# Altium schematic sheet TW3-16上盖控制板V0.2.SchDoc
size A3
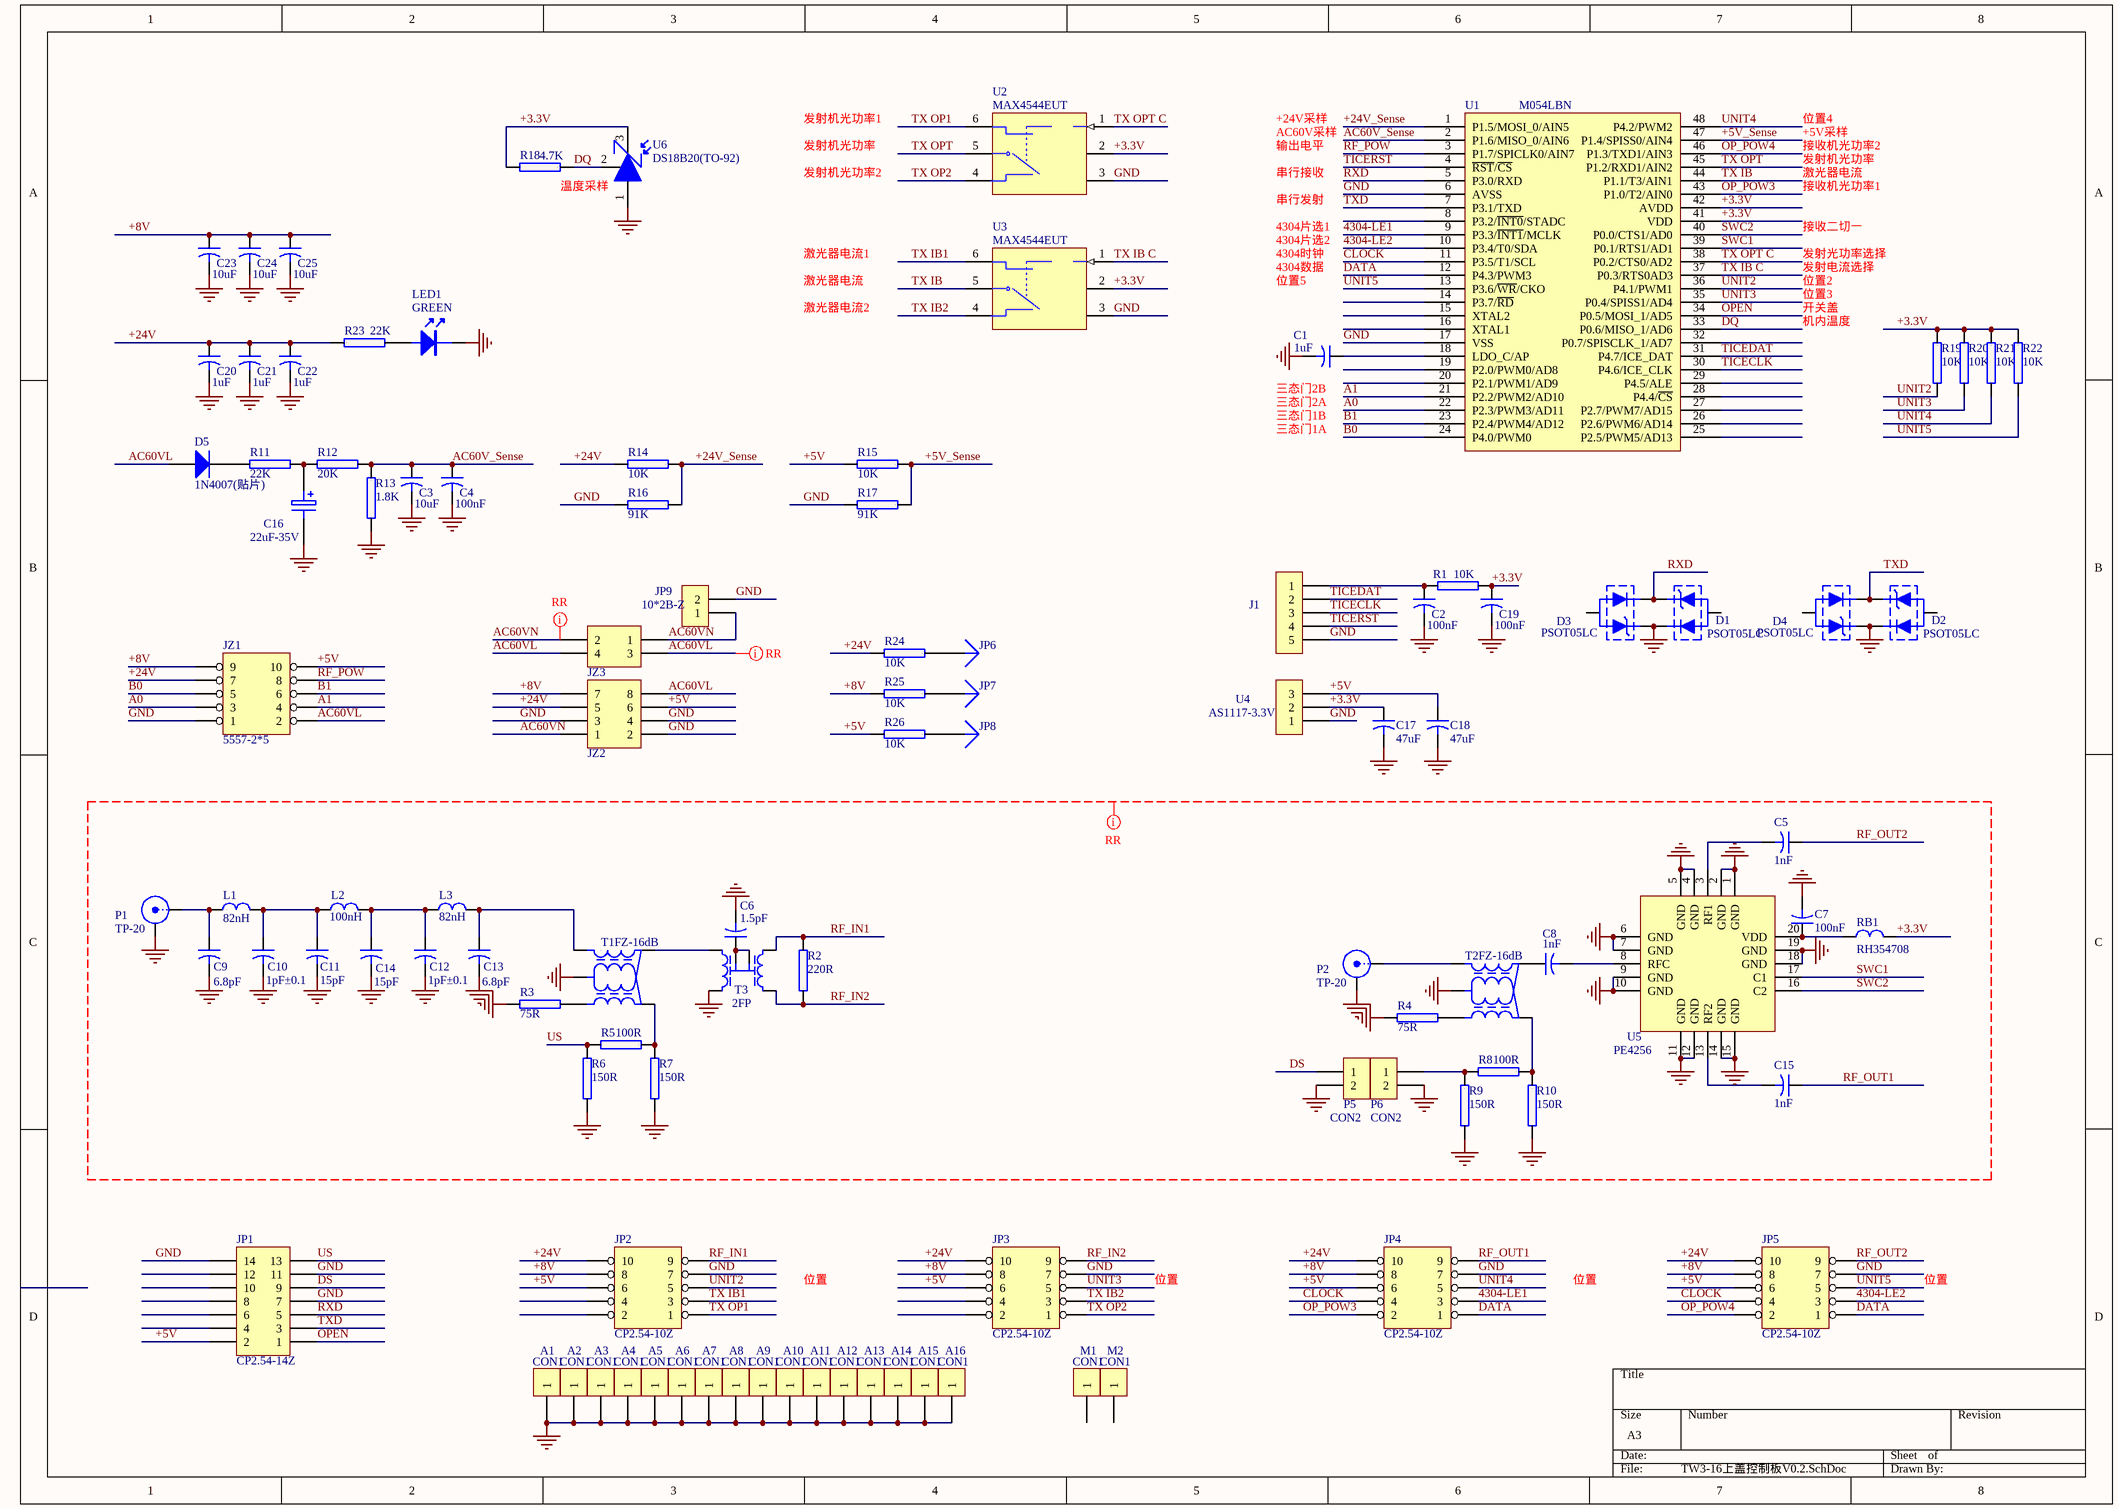
[diagram p0: TW3-16上盖控制板V0.2.SchDoc]

## Parts
A1  CON1  [PAD-6mm]
A2  CON1  [PAD-6mm]
A3  CON1  [PAD-6mm]
A4  CON1  [PAD-6mm]
A5  CON1  [PAD-6mm]
A6  CON1  [PAD-6mm]
A7  CON1  [PAD-6mm]
A8  CON1  [PAD-6mm]
A9  CON1  [PAD-6mm]
A10  CON1  [PAD-6mm]
A11  CON1  [PAD-6mm]
A12  CON1  [PAD-6mm]
A13  CON1  [PAD-6mm]
A14  CON1  [PAD-6mm]
A15  CON1  [PAD-6mm]
A16  CON1  [PAD-6mm]
C1  value 1uF  [0603]  (hidden comment: CT41-0603-B1uF-25V-K)
C2  value 100nF  [0603]  (hidden comment: CT41-0603-B100nF-50V-K)
C3  value 10uF  [1206]  (hidden comment: 16V-10uF±10%-X7R-1206)
C4  value 100nF  [0603]  (hidden comment: CT41-0603-B100nF-50V-K)
C5  value 1nF  [0603]  (hidden comment: CT41-0603-B1nF-50V-J)
C6  value 1.5pF  [0603]  (hidden comment: CC41-0603-CG1.5pF-50V-C)
C7  value 100nF  [0603]  (hidden comment: CT41-0603-B100nF-50V-K)
C8  value 1nF  [0603]  (hidden comment: CT41-0603-B1nF-50V-J)
C9  value 6.8pF  [0603]  (hidden comment: CC41-0603-CG6.8pF-50V-C)
C10  value 1pF±0.1  [0603]  (hidden comment: CC41-0603-CG1pF-50V-B)
C11  value 15pF  [0603]  (hidden comment: CC41-0603-CG15pF-50V-J)
C12  value 1pF±0.1  [0603]  (hidden comment: CC41-0603-CG1pF-50V-B)
C13  value 6.8pF  [0603]  (hidden comment: CC41-0603-CG6.8pF-50V-C)
C14  value 15pF  [0603]  (hidden comment: CC41-0603-CG15pF-50V-J)
C15  value 1nF  [0603]  (hidden comment: CT41-0603-B1nF-50V-J)
C16  value 22uF-35V  [RB-SMT-6.3X5.4]  (hidden comment: SCD11-6.3*5.4-22uF-35V-K)
C17  value 47uF  [1206]  (hidden comment: CT41-1206-F476-10V-M)
C18  value 47uF  [1206]  (hidden comment: CT41-1206-F476-10V-M)
C19  value 100nF  [0603]  (hidden comment: CT41-0603-B100nF-50V-K)
C20  value 1uF  [1206]  (hidden comment: CT41-1206-B1uF-50V-K)
C21  value 1uF  [1206]  (hidden comment: CT41-1206-B1uF-50V-K)
C22  value 1uF  [1206]  (hidden comment: CT41-1206-B1uF-50V-K)
C23  value 10uF  [1206]  (hidden comment: 16V-10uF±10%-X7R-1206)
C24  value 10uF  [1206]  (hidden comment: 16V-10uF±10%-X7R-1206)
C25  value 10uF  [1206]  (hidden comment: 16V-10uF±10%-X7R-1206)
D1  value PSOT05LC  [SOT-23]  (hidden comment: 集成块)
D2  value PSOT05LC  [SOT-23]  (hidden comment: 集成块)
D3  value PSOT05LC  [SOT-23]  (hidden comment: 集成块)
D4  value PSOT05LC  [SOT-23]  (hidden comment: 集成块)
D5  1N4007(贴片)  [DO-SMA]
J1  IDC单排插针  [SIP5]  (value not drawn)
JP1  Vallue: CP2.54-14Z  [IDC-14Z]  (hidden comment: CP2.54-14Z-S-K(排母))
JP2  value CP2.54-10Z  [IDC-10Z]  (hidden comment: CP2.54-10Z-S-K(排母))
JP3  value CP2.54-10Z  [IDC-10Z]  (hidden comment: CP2.54-10Z-S-K(排母))
JP4  value CP2.54-10Z  [IDC-10Z]  (hidden comment: CP2.54-10Z-S-K(排母))
JP5  value CP2.54-10Z  [IDC-10Z]  (hidden comment: CP2.54-10Z-S-K(排母))
JP6  CK-1A  [TEST1]  (value not drawn)
JP7  CK-1A  [TEST1]  (value not drawn)
JP8  CK-1A  [TEST1]  (value not drawn)
JP9  10*2B-Z  [AC-10mm]
JZ1  5557-2*5  [5557-2*5]
JZ2  5557-8A  [5557-2X4]  (value not drawn)
JZ3  5557-2*2座  [5557-2X2]  (value not drawn)
L1  value 82nH  [0805]  (hidden comment: HDW0805UC082JGT)
L2  value 100nH  [0805]  (hidden comment: HDW0805UCR10JGT)
L3  value 82nH  [0805]  (hidden comment: HDW1008UC082JGT)
LED1  value GREEN  [1206-D]  (hidden comment: LED-1206-G(SMD))
M1  CON1  [MArK-1]
M2  CON1  [MArK-1]
P1  value TP-20  [PAD-DLJT2]  (hidden comment: 02TV阳座)
P2  value TP-20  [PAD-DLJT2]  (hidden comment: 02TV阳座)
P5  CON2  [PAD-DLJT2]
P6  CON2  [PAD-DLJT2]
R1  value 10K  [0603]  (hidden comment: SRI11-0603-10KΩ-J)
R2  value 220R  [0603]  (hidden comment: SRI11-0603-220Ω-J)
R3  value 75R  [0603]  (hidden comment: SRI11-0603-75Ω-J)
R4  value 75R  [0603]  (hidden comment: SRI11-0603-75Ω-J)
R5  value 100R  [0603]  (hidden comment: SRI11-0603-100Ω-J)
R6  value 150R  [0603]  (hidden comment: SRI11-0603-150Ω-J)
R7  value 150R  [0603]  (hidden comment: SRI11-0603-150Ω-J)
R8  value 100R  [0603]  (hidden comment: SRI11-0603-100Ω-J)
R9  value 150R  [0603]  (hidden comment: SRI11-0603-150Ω-J)
R10  value 150R  [0603]  (hidden comment: SRI11-0603-150Ω-J)
R11  value 22K  [0805]  (hidden comment: SRI11-0805-22KΩ-J)
R12  value 20K  [0805]  (hidden comment: SRI11-0805-20KΩ-J)
R13  value 1.8K  [0805]  (hidden comment: SRI11-0805-1.8KΩ-J)
R14  value 10K  [0603]  (hidden comment: SRI11-0603-10KΩ-J)
R15  value 10K  [0603]  (hidden comment: SRI11-0603-10KΩ-J)
R16  value 91K  [0603]  (hidden comment: SRI11-0603-91KΩ-J)
R17  value 91K  [0603]  (hidden comment: SRI11-0603-91KΩ-J)
R18  value 4.7K  [0603]  (hidden comment: SRI11-0603-4.7KΩ-J)
R19  value 10K  [0603]  (hidden comment: SRI11-0603-10KΩ-J)
R20  value 10K  [0603]  (hidden comment: SRI11-0603-10KΩ-J)
R21  value 10K  [0603]  (hidden comment: SRI11-0603-10KΩ-J)
R22  value 10K  [0603]  (hidden comment: SRI11-0603-10KΩ-J)
R23  value 22K  [0603]  (hidden comment: SRI11-0603-22KΩ-J)
R24  value 10K  [0603]  (hidden comment: SRI11-0603-10KΩ-J)
R25  value 10K  [0603]  (hidden comment: SRI11-0603-10KΩ-J)
R26  value 10K  [0603]  (hidden comment: SRI11-0603-10KΩ-J)
RB1  RH354708  [L12MM]
T1  value FZ-16dB  [T-SM16]  (hidden comment: F06401C)
T2  value FZ-16dB  [T-SM16]  (hidden comment: F06401C)
T3  value 2FP  [STB-RG33]  (hidden comment: F06502S)
U1  M054LBN  [LQFP-48]
U2  value MAX4544EUT  [SOT23-6]  (hidden comment: 集成块)
U3  value MAX4544EUT  [SOT23-6]  (hidden comment: 集成块)
U4  AS1117-3.3V  [SOT-223-3L]
U5  value PE4256  [QFN-20]  (hidden comment: PE4256DS)
U6  DS18B20(TO-92)  [TO-92-78L]

## Nets
GND: A1.1 A2.1 A3.1 A4.1 A5.1 A6.1 A7.1 A8.1 A9.1 A10.1 A11.1 A12.1 A13.1 A14.1 A15.1 A16.1 C1.2 C2.2 C3.2 C4.2 C6.2 C7.2 C9.2 C10.2 C11.2 C12.2 C13.2 C14.2 C16.2 C17.2 C18.2 C19.2 C20.2 C21.2 C22.2 C23.2 C24.2 C25.2 D1.2 D2.2 D3.1 D4.1 J1.5 JP1.7 JP1.11 JP1.14 JP2.7 JP3.7 JP4.7 JP5.7 JP9.2 JZ1.1 JZ2.2 JZ2.3 JZ2.4 LED1.2(C) P1.2(Y) P2.2(Y) P5.2 P6.2 R3.2 R4.2 R6.2 R7.2 R9.2 R10.2 R13.2 R16.2 R17.2 T1.5 T2.5 T3.2 U1.6(AVSS) U1.17(VSS) U2.3(GND) U3.3(GND) U4.1 U5.1(GND) U5.2(GND) U5.4(GND) U5.5(GND) U5.6(GND) U5.7(GND) U5.9(GND) U5.10(GND) U5.11(GND) U5.12(GND) U5.14(GND) U5.15(GND) U5.18(GND) U5.19(GND) U6.1(GND)
4304-LE1: JP4.3 U1.9(P3.3/~{INT1}/MCLK)
4304-LE2: JP5.3 U1.10(P3.4/T0/SDA)
+3.3V: C17.1 C19.1 R1.2 R18.2 R19.1 R20.1 R21.1 R22.1 RB1.2 U1.41(VDD) U1.42(AVDD) U2.2(V+) U3.2(V+) U4.2 U6.3(Vdd)
+5V: C18.1 JP1.2 JP2.6 JP3.6 JP4.6 JP5.6 JZ1.10 JZ2.6 R15.2 R26.2 U4.3
+5V_Sense: R15.1 R17.1 U1.47(P1.4/SPISS0/AIN4)
+8V: C23.1 C24.1 C25.1 JP2.8 JP3.8 JP4.8 JP5.8 JZ1.9 JZ2.7 R25.2
+24V: C20.1 C21.1 C22.1 JP2.10 JP3.10 JP4.10 JP5.10 JZ1.7 JZ2.5 R14.2 R23.1 R24.2
+24V_Sense: R14.1 R16.1 U1.1(P1.5/MOSI_0/AIN5)
A0: JZ1.3 U1.22(P2.3/PWM3/AD11)
A1: JZ1.4 U1.21(P2.2/PWM2/AD10)
AC60V_Sense: C3.1 C4.1 R12.2 R13.1 U1.2(P1.6/MISO_0/AIN6)
AC60VL: D5.1(A) JZ1.2 JZ2.8 JZ3.3 JZ3.4
AC60VN: JP9.1 JZ2.1 JZ3.1 JZ3.2
B0: JZ1.5 U1.24(P4.0/PWM0)
B1: JZ1.6 U1.23(P2.4/PWM4/AD12)
CLOCK: JP4.4 JP5.4 U1.11(P3.5/T1/SCL)
DATA: JP4.1 JP5.1 U1.12(P4.3/PWM3)
DQ: R18.1 U1.33(P0.6/MISO_1/AD6) U6.2(DQ)
DS: JP1.9 P5.1
OP_POW3: JP4.2 U1.43(P1.0/T2/AIN0)
OP_POW4: JP5.2 U1.46(P1.3/TXD1/AIN3)
OPEN: JP1.1 U1.34(P0.5/MOSI_1/AD5)
RF_IN1: JP2.9 R2.2 T3.4(OUT)
RF_IN2: JP3.9 R2.1 T3.3(OUT)
RF_OUT1: C15.1 JP4.9
RF_OUT2: C5.1 JP5.9
RF_POW: JZ1.8 U1.3(P1.7/SPICLK0/AIN7)
RXD: D1.1 D3.2 JP1.5 U1.5(P3.0/RXD)
SWC1: U1.39(P0.1/RTS1/AD1) U5.17(C1)
SWC2: U1.40(P0.0/CTS1/AD0) U5.16(C2)
TICECLK: J1.3 U1.30(P4.6/ICE_CLK)
TICEDAT: J1.2 U1.31(P4.7/ICE_DAT)
TICERST: J1.4 U1.4(~{RST}/~{CS})
TX IB: U1.44(P1.1/T3/AIN1) U3.5(COM)
TX IB1: JP2.3 U3.6(NO)
TX IB2: JP3.3 U3.4(NC)
TX IB C: U1.37(P0.3/RTS0AD3) U3.1(IN)
TX OP1: JP2.1 U2.6(NO)
TX OP2: JP3.1 U2.4(NC)
TX OPT: U1.45(P1.2/RXD1/AIN2) U2.5(COM)
TX OPT C: U1.38(P0.2/CTS0/AD2) U2.1(IN)
TXD: D2.1 D4.2 JP1.3 U1.7(P3.1/TXD)
UNIT2: JP2.5 R19.2 U1.36(P4.1/PWM1)
UNIT3: JP3.5 R20.2 U1.35(P0.4/SPISS1/AD4)
UNIT4: JP4.5 R21.2 U1.48(P4.2/PWM2)
UNIT5: JP5.5 R22.2 U1.13(P3.6/~{WR}/CKO)
US: JP1.13 R5.2 R6.1
NetC1_1: C1.1 U1.18(LDO_C/AP)
NetC2_1: C2.1 J1.1 R1.1
NetC5_2: C5.2 U5.3(RF1)
NetC6_1: C6.1 T3.5 T3.6
NetC7_1: C7.1 RB1.1 U5.20(VDD)
NetC8_1: C8.1 T2.2
NetC8_2: C8.2 U5.8(RFC)
NetC9_1: C9.1 L1.1 P1.1(X)
NetC10_1: C10.1 C11.1 L1.2 L2.1
NetC12_1: C12.1 C14.1 L2.2 L3.1
NetC13_1: C13.1 L3.2 T1.1
NetC15_2: C15.2 U5.13(RF2)
NetC16_1: C16.1 R11.2 R12.1
NetD5_2: D5.2(K) R11.1
NetJP6_1: JP6.1 R24.1
NetJP7_1: JP7.1 R25.1
NetJP8_1: JP8.1 R26.1
NetLED1_1: LED1.1(A) R23.2
NetP2_1: P2.1(X) T2.1
NetP6_1: P6.1 R8.2 R9.1
NetR3_1: R3.1 T1.3
NetR4_1: R4.1 T2.3
NetR5_1: R5.1 R7.1 T1.4
NetR8_1: R8.1 R10.1 T2.4
NetT1_2: T1.2 T3.1(IN)

Not connected (* = marked no-connect by the designer): D1 3; D2 3; D3 3; D4 3; JP1 4 6 8 10 12; JP2 2 4; JP3 2 4; M1 1; M2 1; U1 8(P3.2/~{INT0}/STADC) 14(P3.7/~{RD}) 15(XTAL2) 16(XTAL1) 19(P2.0/PWM0/AD8) 20(P2.1/PWM1/AD9) 25(P2.5/PWM5/AD13) 26(P2.6/PWM6/AD14) 27(P2.7/PWM7/AD15) 28(P4.4/~{CS}) 29(P4.5/ALE) 32(P0.7/SPISCLK_1/AD7)

## Layout directives
net class RF: +3.3V, AC60VL, AC60VN, DS, GND, RF_IN1, RF_IN2, RF_OUT1, RF_OUT2, SWC1, SWC2, US

## Notes on the sheet
- 发射机光功率1
- 发射机光功率2
- 发射机光功率
- 输出电平
- +24V采样
- AC60V采样
- 串行接收
- 接收机光功率2
- 位置4
- +5V采样
- 激光器电流
- (near R18) 温度采样
- 4304片选1
- 4304片选2
- 串行发射
- 接收机光功率1
- 接收二切一
- 激光器电流1
- 激光器电流2
- 4304时钟
- 4304数据
- 位置5
- 位置2
- 位置3
- 开关盖
- 发射光功率选择
- 发射电流选择
- 机内温度
- 三态门1A
- 三态门1B
- (near C1) 三态门2A
- (near C1) 三态门2B
- 位置

## Library data of the parts
A1-A16 M1 M2 = CON1: Connector
C1 = Cap2: 贴片电容; Materiel Code: 30.01.00.0001500
C2 C4 C7 C19 = Cap2: 贴片电容; Materiel Code: 30.01.00.0001400
C3 C23-C25 = Cap2: 贴片电容; Materiel Code: 30.01.00.0015100
C5 C8 C15 = Cap2: 贴片电容; Materiel Code: 30.01.00.0001102
C6 = Cap2: 贴片电容; Materiel Code: 30.01.00.0002000
C9 C13 = Cap2: 贴片电容; Materiel Code: 30.01.00.0033100
C10 C12 = Cap2: 贴片电容; Materiel Code: 30.01.00.0001901
C11 C14 = Cap2: 贴片电容; Materiel Code: 30.01.00.0032200
C16 = ELECTRO1: 贴片铝电解电容; Materiel Code: 30.01.02.0000200
C17 C18 = Cap2: 贴片电容; Materiel Code: 30.01.00.0027600
C20-C22 = Cap2: 贴片电容; Materiel Code: 30.01.00.0015000
D1-D4 = PSOT05LC: Materiel Code: 30.05.00.0010800
D5 = Diode 1N4007: 贴片二极管; Materiel Code: 30.03.01.0000200; Value: 1N4007
J1 = CON5: 1×5（2.54mm）; Materiel Code: 30.08.06.0001000; Value: 1×5（2.54mm）
JP1 = Header 7X2: 双排14芯插座; Materiel Code: 30.09.04.0003700
JP2-JP5 = HEADER 5X2: 双排10芯插座; Materiel Code: 30.09.04.0003100
JP6-JP8 = Plug: 测试柱; Materiel Code: 30.09.06.0004800; Value: *
JP9 = CON2: 二芯针座; Materiel Code: 30.09.06.0000100; Value: *
JZ1 = HEADER 5X2: 十芯插座; Materiel Code: 30.08.06.0008900; Value: *
JZ2 = Header 4X2H: 八芯插座; Materiel Code: 30.09.06.0018400; Value: *
JZ3 = Header 2X2H: 4芯插座; Materiel Code: 30.09.06.0024000; Value: *
L1 L3 = L3: 陶瓷线绕电感; Materiel Code: 30.02.00.0001500
L2 = L3: 陶瓷线绕电感; Materiel Code: 30.02.00.0002700
LED1 = LED-1: 发光二极管; Materiel Code: 30.10.03.0000200
P1 P2 = SMB: 测试插孔; Materiel Code: 30.09.06.0017300
P5 P6 = CON2: Connector; Materiel Code: *; Value: *
R1 R14 R15 R19-R22 R24-R26 = RES1: 贴片电阻; Materiel Code: 30.00.00.0007100
R2 = RES1: 贴片电阻; Materiel Code: 30.00.00.0005000
R3 R4 = RES1: 贴片电阻; Materiel Code: 30.00.00.0004000
R5 R8 = RES1: 贴片电阻; Materiel Code: 30.00.00.0004200
R6 R7 R9 R10 = RES1: 贴片电阻; Materiel Code: 30.00.00.0004600
R11 = RES1: 贴片电阻; Materiel Code: 30.00.00.0017900
R12 = RES1: 贴片电阻; Materiel Code: 30.00.00.0017800
R13 = RES1: 贴片电阻; Materiel Code: 30.00.00.0015900
R16 R17 = RES1: 贴片电阻; Materiel Code: 30.00.00.0007500
R18 = RES1: 贴片电阻; Materiel Code: 30.00.00.0006900
R23 = RESSMD_0603: 贴片电阻; Materiel Code: 30.00.00.0057000
RB1 = L3: 插件磁珠; Materiel Code: 30.02.10.0000900; Value: RH354708
T1 T2 = FZ: 高频变压器; Materiel Code: 30.02.09.0013200
T3 = FP: 高频变压器; Materiel Code: 30.02.09.0012700
U1 = M052LBN: 集成块; Materiel Code: 30.05.00.0043400; Value: M054LBN
U2 U3 = MAX4544EUT-T: MAX4544EUT; Materiel Code: 30.05.00.0008700
U4 = CON3: 集成块; Materiel Code: 30.05.00.0042301; Value: AS1117-3.3V
U5 = PE4256: 集成块; Materiel Code: 30.05.00.0039800
U6 = DS18B20: 集成块; Materiel Code: 30.05.00.0041100; Value: *